# Altium project Psat Payload.PrjPcb
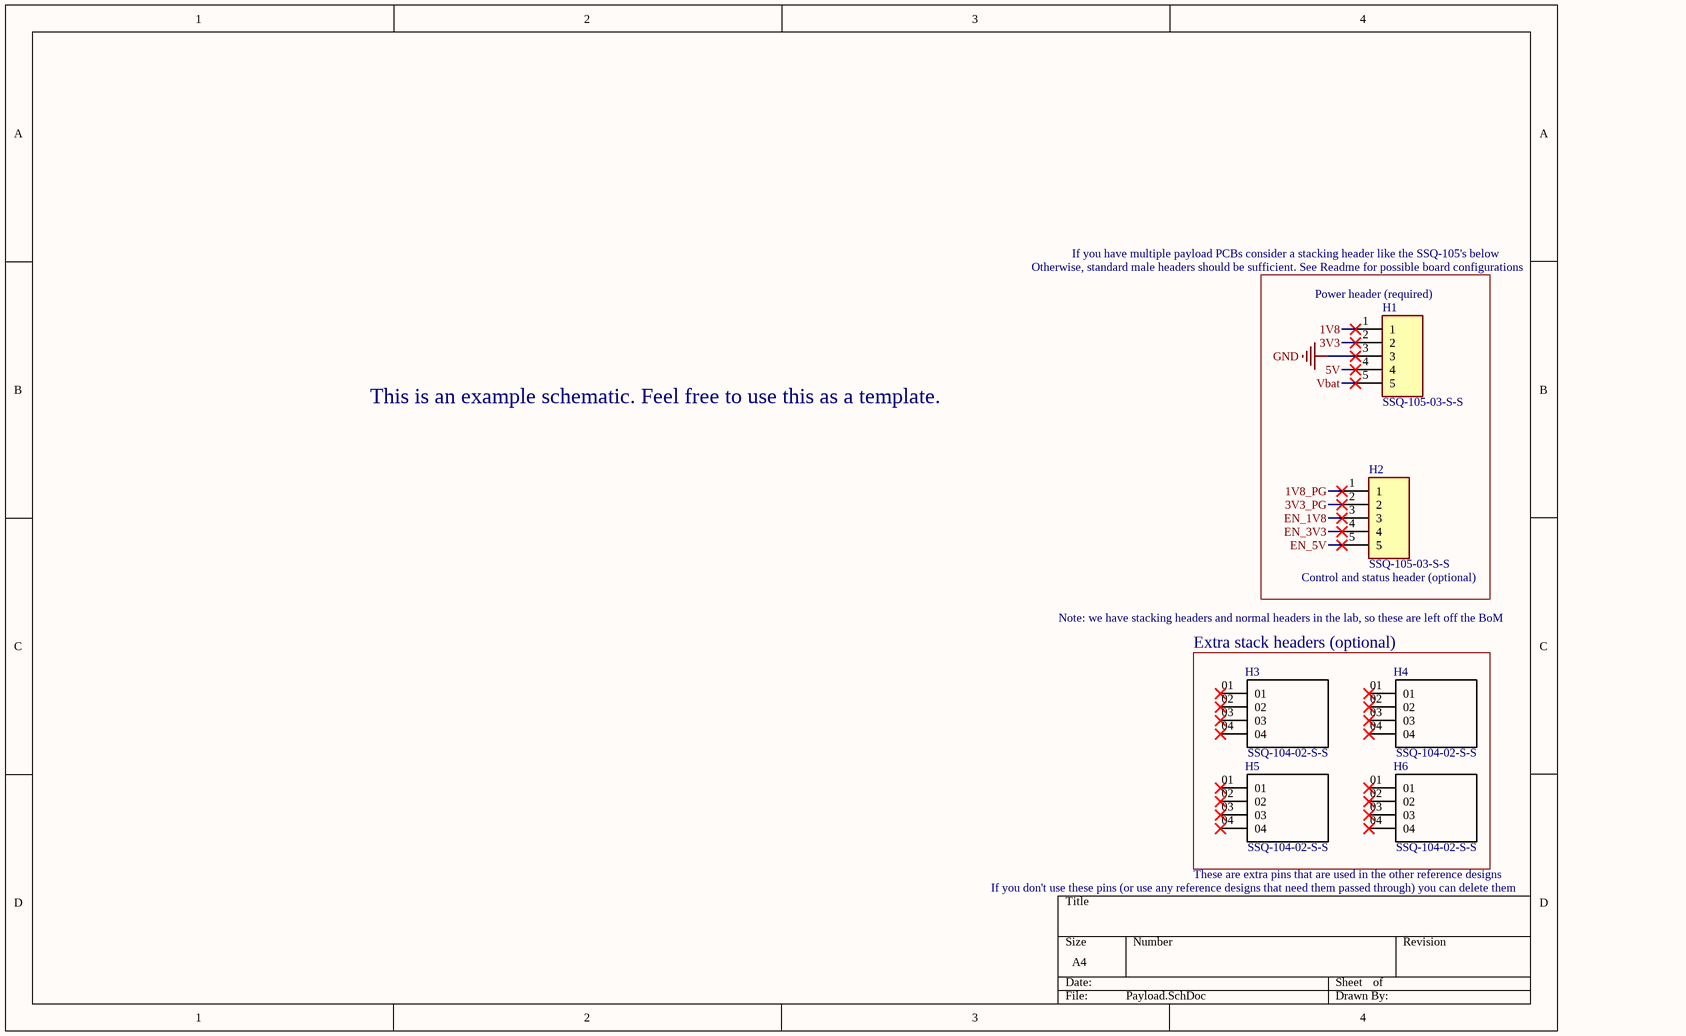
[diagram p0: Payload.SchDoc]
1 sheet, 6 parts. Net scope: hierarchical (ports join the sheet entries above them; power ports are global).
Board file: Payload.PcbDoc

## Sheet Payload.SchDoc
size A4

### Parts
H1  SSQ-105-03-S-S  [SAMTEC_SSQ-105-03-S-S]  (no BOM)
H2  SSQ-105-03-S-S  [SAMTEC_SSQ-105-03-S-S]  (no BOM)
H3  SSQ-104-02-S-S  [*SAMTEC_SSQ-104-02-S-S_SSQ-104-02-S-S(Primary)]  (no BOM)
H4  SSQ-104-02-S-S  [*SAMTEC_SSQ-104-02-S-S_SSQ-104-02-S-S(Primary)]  (no BOM)
H5  SSQ-104-02-S-S  [*SAMTEC_SSQ-104-02-S-S_SSQ-104-02-S-S(Primary)]  (no BOM)
H6  SSQ-104-02-S-S  [*SAMTEC_SSQ-104-02-S-S_SSQ-104-02-S-S(Primary)]  (no BOM)

### Blocks framed on the sheet
Extra stack headers (optional): H3-H6

### Nets
GND: H1.3
1V8: H1.1
1V8_PG: H2.1
3V3: H1.2
3V3_PG: H2.2
5V: H1.4
EN_1V8: H2.3
EN_3V3: H2.4
EN_5V: H2.5
Vbat: H1.5

Not connected (* = marked no-connect by the designer): H3 01* 02* 03* 04*; H4 01* 02* 03* 04*; H5 01* 02* 03* 04*; H6 01* 02* 03* 04*

### Notes on the sheet
- Otherwise, standard male headers should be sufficient. See Readme for possible board configurations
- If you have multiple payload PCBs consider a stacking header like the SSQ-105's below
- (near H1) Power header (required)
- This is an example schematic. Feel free to use this as a template.
- (near H2) Control and status header (optional)
- Note: we have stacking headers and normal headers in the lab, so these are left off the BoM
- If you don't use these pins (or use any reference designs that need them passed through) you can delete them
- These are extra pins that are used in the other reference designs

### Library data of the parts
H1 H2 = SSQ-105-03-S-S: MF: {'manufacturer': u'Samtec Inc.'}; Package: None; Price: None; Value: *; MP: SSQ-105-03-S-S; Availability: Unavailable
H3-H6 = SSQ-104-02-S-S: SnapEDA_Link: https://www.snapeda.com/parts/SSQ-104-02-S-S/Samtec/view-part/?ref=snap; Check_prices: https://www.snapeda.com/parts/SSQ-104-02-S-S/Samtec/view-part/?ref=eda; Value: *